# EAGLE design sensorstation_ok (EAGLE 6.2)
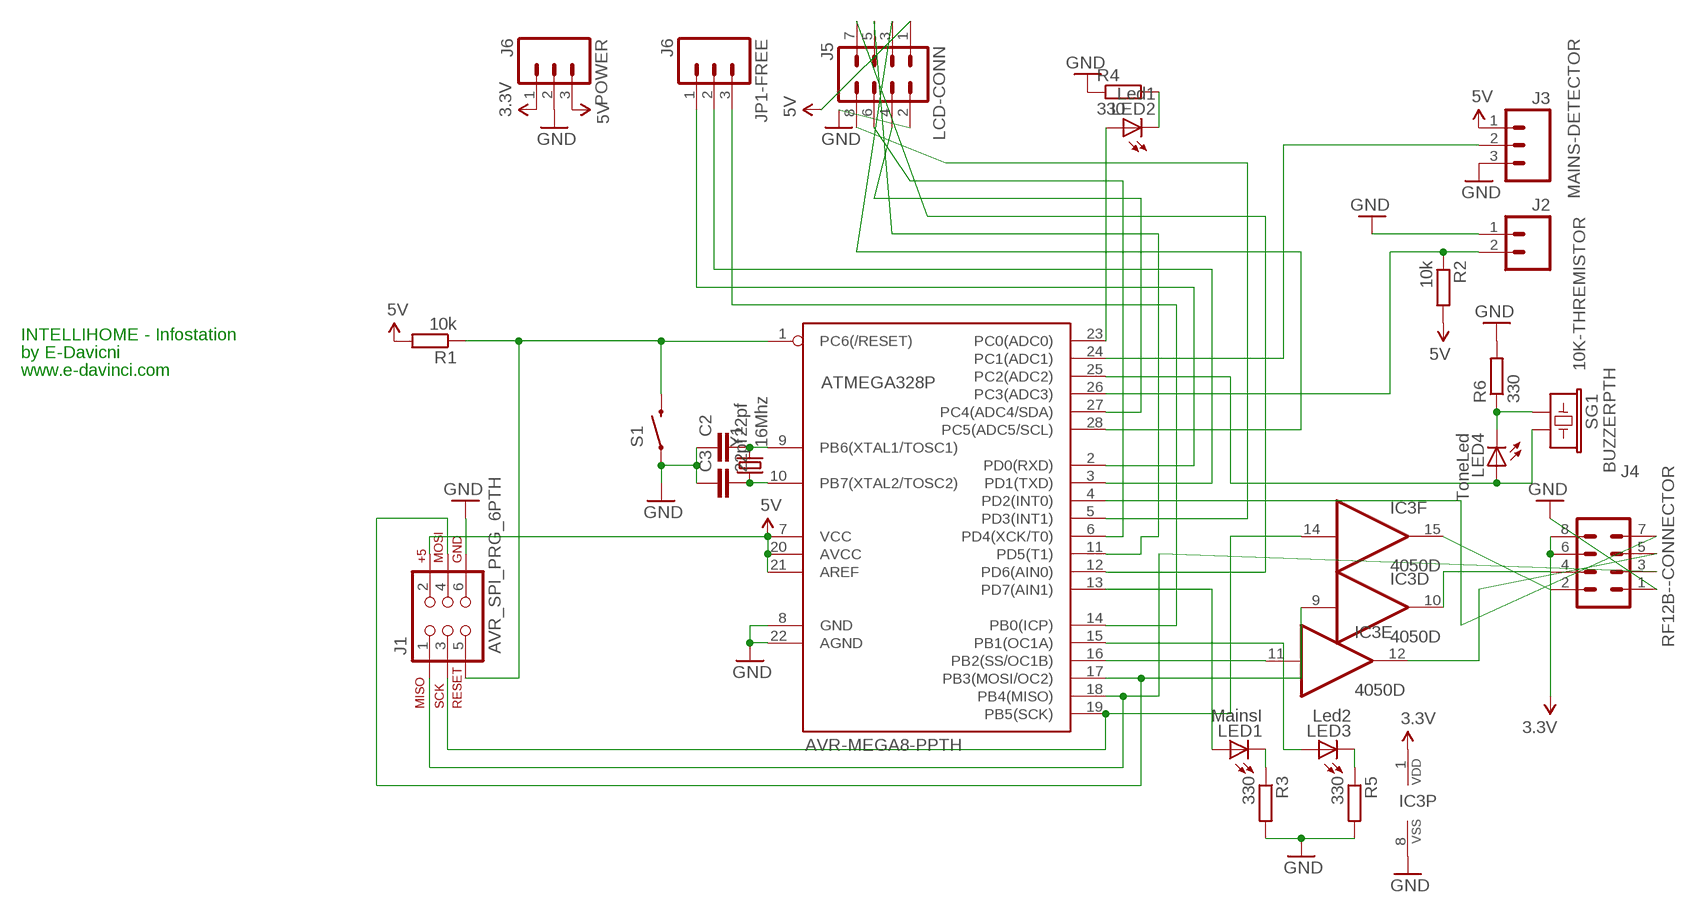
[diagram p0: schematic, sheet 1]

## Parts
10K-THREMISTOR  J2  M02PTH  [1X02]
ATMEGA328P  AVR-MEGA8-PPTH  [DIL28-3]
C2  22pf  CAPPTH  [CAP-PTH-SMALL]
C3  22pf  CAPPTH  [CAP-PTH-SMALL]
IC3  4050D  [SO16]
J1  AVR_SPI_PRG_6PTH  [2X3]
JP1-FREE  J6  M03PTH  [1X03]
LCD-CONN  J5  M04X2  [2X4]
LED1  MainsI  LED3MM  [LED3MM]
LED2  Led1  LED3MM  [LED3MM]
LED3  Led2  LED3MM  [LED3MM]
LED4  ToneLed  LED3MM  [LED3MM]
MAINS-DETECTOR  J3  M03PTH  [1X03]
POWER  J6  M03PTH  [1X03]
R1  10k  R-EU_0207/2V  [0207/2V]
R2  10k  R-EU_0207/2V  [0207/2V]
R3  330  R-EU_0207/2V  [0207/2V]
R4  330  R-EU_0207/2V  [0207/2V]
R5  330  R-EU_0207/2V  [0207/2V]
R6  330  R-EU_0207/2V  [0207/2V]
RF12B--CONNECTOR  J4  M04X2  [2X4]
S1  SWITCH-MOMENTARY-2PTH  [TACTILE-PTH]
SG1  BUZZERPTH  [BUZZER-12MM]
Y1  16Mhz  CRYSTALHC49US  [HC49US]

## Nets
3.3V: IC3.1(P:VDD) POWER.1 RF12B--CONNECTOR.6 RF12B--CONNECTOR.8
5V: ATMEGA328P.7(VCC) ATMEGA328P.20(AVCC) ATMEGA328P.21(AREF) J1.2 LCD-CONN.1 MAINS-DETECTOR.1 POWER.3 R1.2 R2.2
GND: 10K-THREMISTOR.1 ATMEGA328P.8(GND) ATMEGA328P.22(AGND) C2.1 C3.1 IC3.8(P:VSS) J1.6 LCD-CONN.2 MAINS-DETECTOR.3 POWER.2 R3.2 R4.1 R5.2 R6.2 RF12B--CONNECTOR.1 S1.1
N$1: ATMEGA328P.4(PD2(INT0)) RF12B--CONNECTOR.7
N$2: ATMEGA328P.16(PB2(SS/OC1B)) IC3.11(E:I)
N$3: ATMEGA328P.19(PB5(SCK)) IC3.14(F:I) J1.3
N$4: ATMEGA328P.17(PB3(MOSI/OC2)) IC3.9(D:I) J1.4
N$5: IC3.10(D:O) RF12B--CONNECTOR.4
N$6: ATMEGA328P.9(PB6(XTAL1/TOSC1)) C2.2 Y1.2
N$7: ATMEGA328P.10(PB7(XTAL2/TOSC2)) C3.2 Y1.1
N$8: ATMEGA328P.24(PC1(ADC1)) MAINS-DETECTOR.2
N$9: 10K-THREMISTOR.2 ATMEGA328P.26(PC3(ADC3)) R2.1
N$10: LED1.K(C) R3.1
N$11: LED4.K(C) R6.1 SG1.+
N$12: LED2.K(C) R4.2
N$13: LED3.K(C) R5.1
N$14: ATMEGA328P.23(PC0(ADC0)) LED2.A
N$15: ATMEGA328P.15(PB1(OC1A)) LED3.A
N$16: ATMEGA328P.25(PC2(ADC2)) LED4.A SG1.-
N$17: ATMEGA328P.14(PB0(ICP)) JP1-FREE.3
N$18: IC3.15(F:O) RF12B--CONNECTOR.2
N$20: IC3.12(E:O) RF12B--CONNECTOR.5
N$22: ATMEGA328P.13(PD7(AIN1)) LED1.A
N$23: ATMEGA328P.18(PB4(MISO)) J1.1 RF12B--CONNECTOR.3
N$24: ATMEGA328P.12(PD6(AIN0)) LCD-CONN.7
N$25: ATMEGA328P.11(PD5(T1)) LCD-CONN.5
N$26: ATMEGA328P.6(PD4(XCK/T0)) LCD-CONN.6
N$27: ATMEGA328P.5(PD3(INT1)) LCD-CONN.8
N$28: ATMEGA328P.3(PD1(TXD)) JP1-FREE.2
N$29: ATMEGA328P.2(PD0(RXD)) JP1-FREE.1
N$30: ATMEGA328P.27(PC4(ADC4/SDA)) LCD-CONN.4
N$31: ATMEGA328P.28(PC5(ADC5/SCL)) LCD-CONN.3
N$34: ATMEGA328P.1(PC6(/RESET)) J1.5 R1.1 S1.3
Unconnected: IC3.2(A:O) IC3.3(A:I) IC3.4(B:O) IC3.5(B:I) IC3.6(C:O) IC3.7(C:I)

## Notes on the sheet
- INTELLIHOME - Infostation
- by E-Davicni
- www.e-davinci.com

## Library data of the parts
10K-THREMISTOR = SparkFun:M02: Header 2 Standard 2-pin 0.1" header. Use with straight break away headers (SKU : PRT-00116), right angle break away headers (PRT-00553), swiss pins (PRT-00743), machine pins (PRT-00117), and female headers (PRT-00115). Molex polarized connector foot print use with SKU : PRT-08233 with associated crimp pins and housings.
ATMEGA328P = SparkFun:AVR-MEGA8-P: MICROCONTROLLER 8 Kbytes FLASH 1 kbytes SRAM 512 bytes EEPROM USART 4-channel 10 bit ADC 2-channel 8 bit ADC
C2 C3 = SparkFun:CAP: Capacitor Standard 0603 ceramic capacitor, and 0.1" leaded capacitor.
IC3 = 40xx:4050: Hex non-inverting BUFFER
J1 = SparkFun:AVR_SPI_PRG_6: AVR ISP 6 Pin This is the reduced ISP connector for AVR programming. Common on Arduino. This footprint will take up less PCB space and can be used with a 10-pin to 6-pin adapter such as SKU: BOB-08508
JP1-FREE MAINS-DETECTOR POWER = SparkFun:M03: Header 3 Standard 3-pin 0.1" header. Use with straight break away headers (SKU : PRT-00116), right angle break away headers (PRT-00553), swiss pins (PRT-00743), machine pins (PRT-00117), and female headers (PRT-00115). Molex polarized connector foot print use with SKU : PRT-08232 with associated crimp pins and housings.
LCD-CONN RF12B--CONNECTOR = SparkFun:M04X2
LED1-LED4 = SparkFun:LED: LEDs Standard schematic elements and footprints for 5mm, 3mm, 1206, and 0603 sized LEDs. 5mm - Spark Fun Electronics SKU : COM-00529 (and others)
R1-R6 = resistor:R-EU_: RESISTOR, European symbol
S1 = SparkFun:SWITCH-MOMENTARY-2
SG1 = SparkFun:BUZZER: Buzzer 12mm Spark Fun Electronics SKU : Comp-Buzzer
Y1 = SparkFun:CRYSTAL: Crystals Various standard crystals. Proven footprints. Spark Fun Electronics SKU : COM-00534

## Board
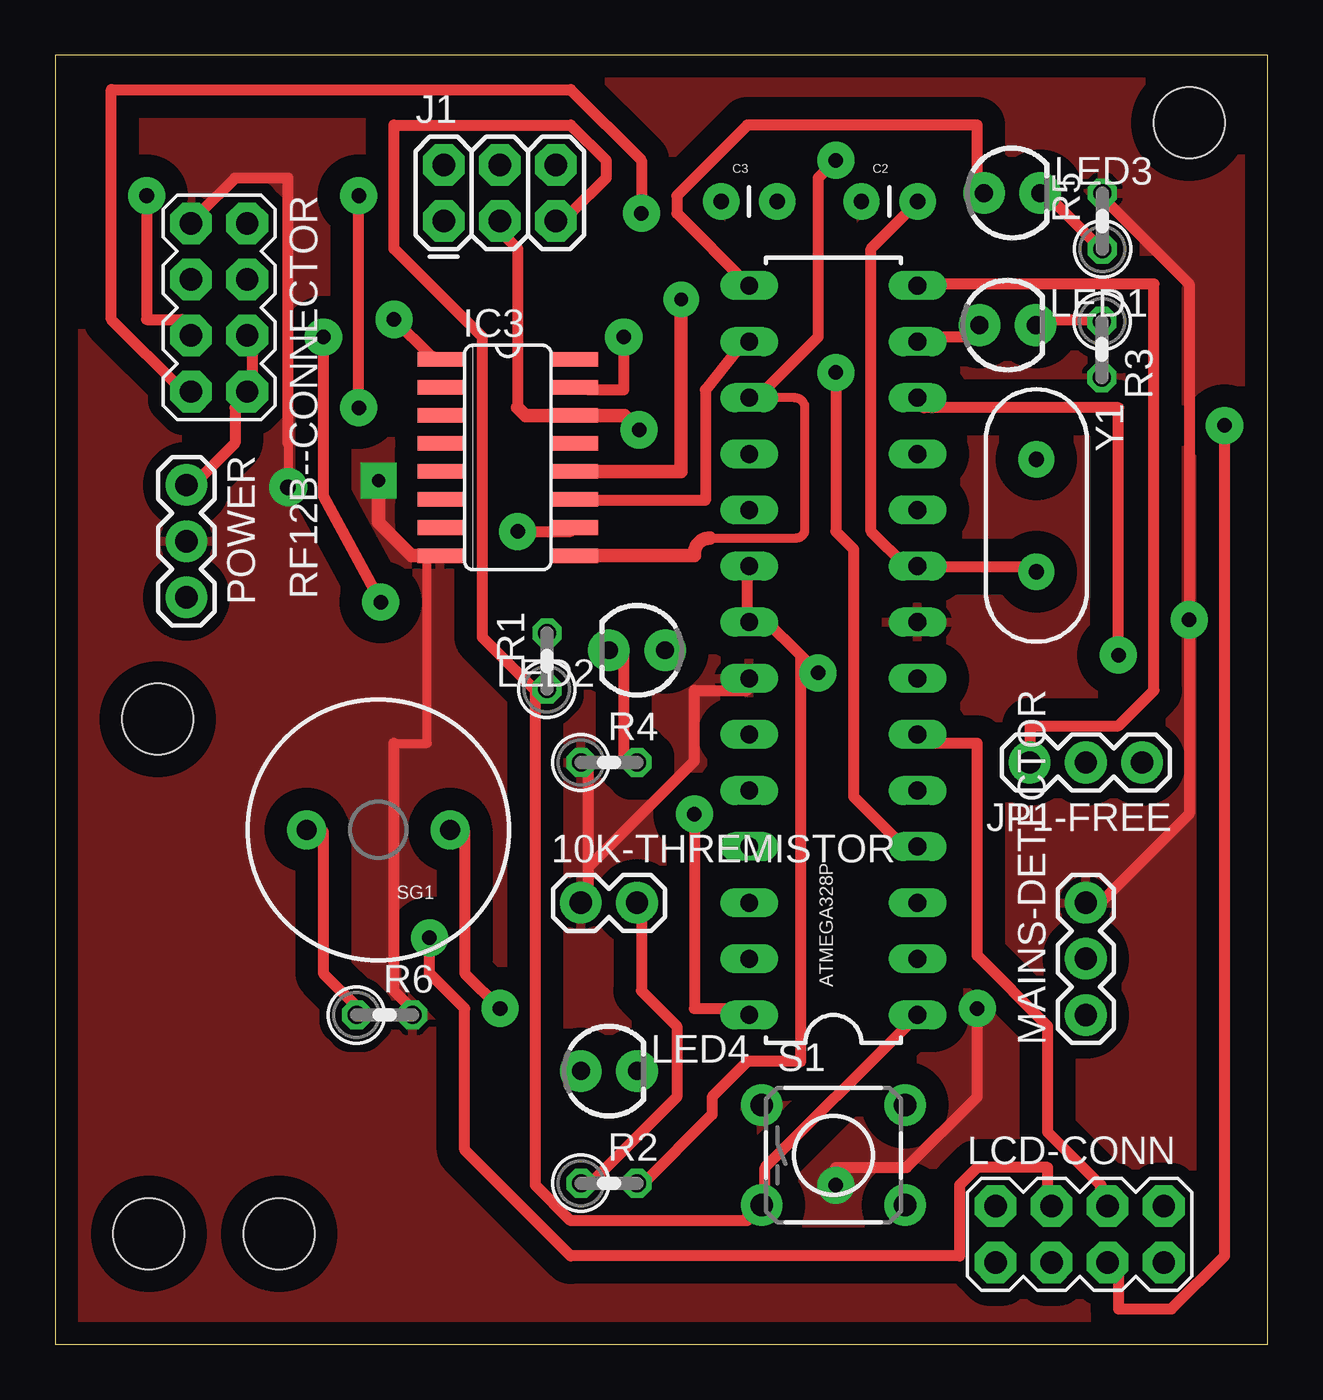
[diagram p1: board, top side]
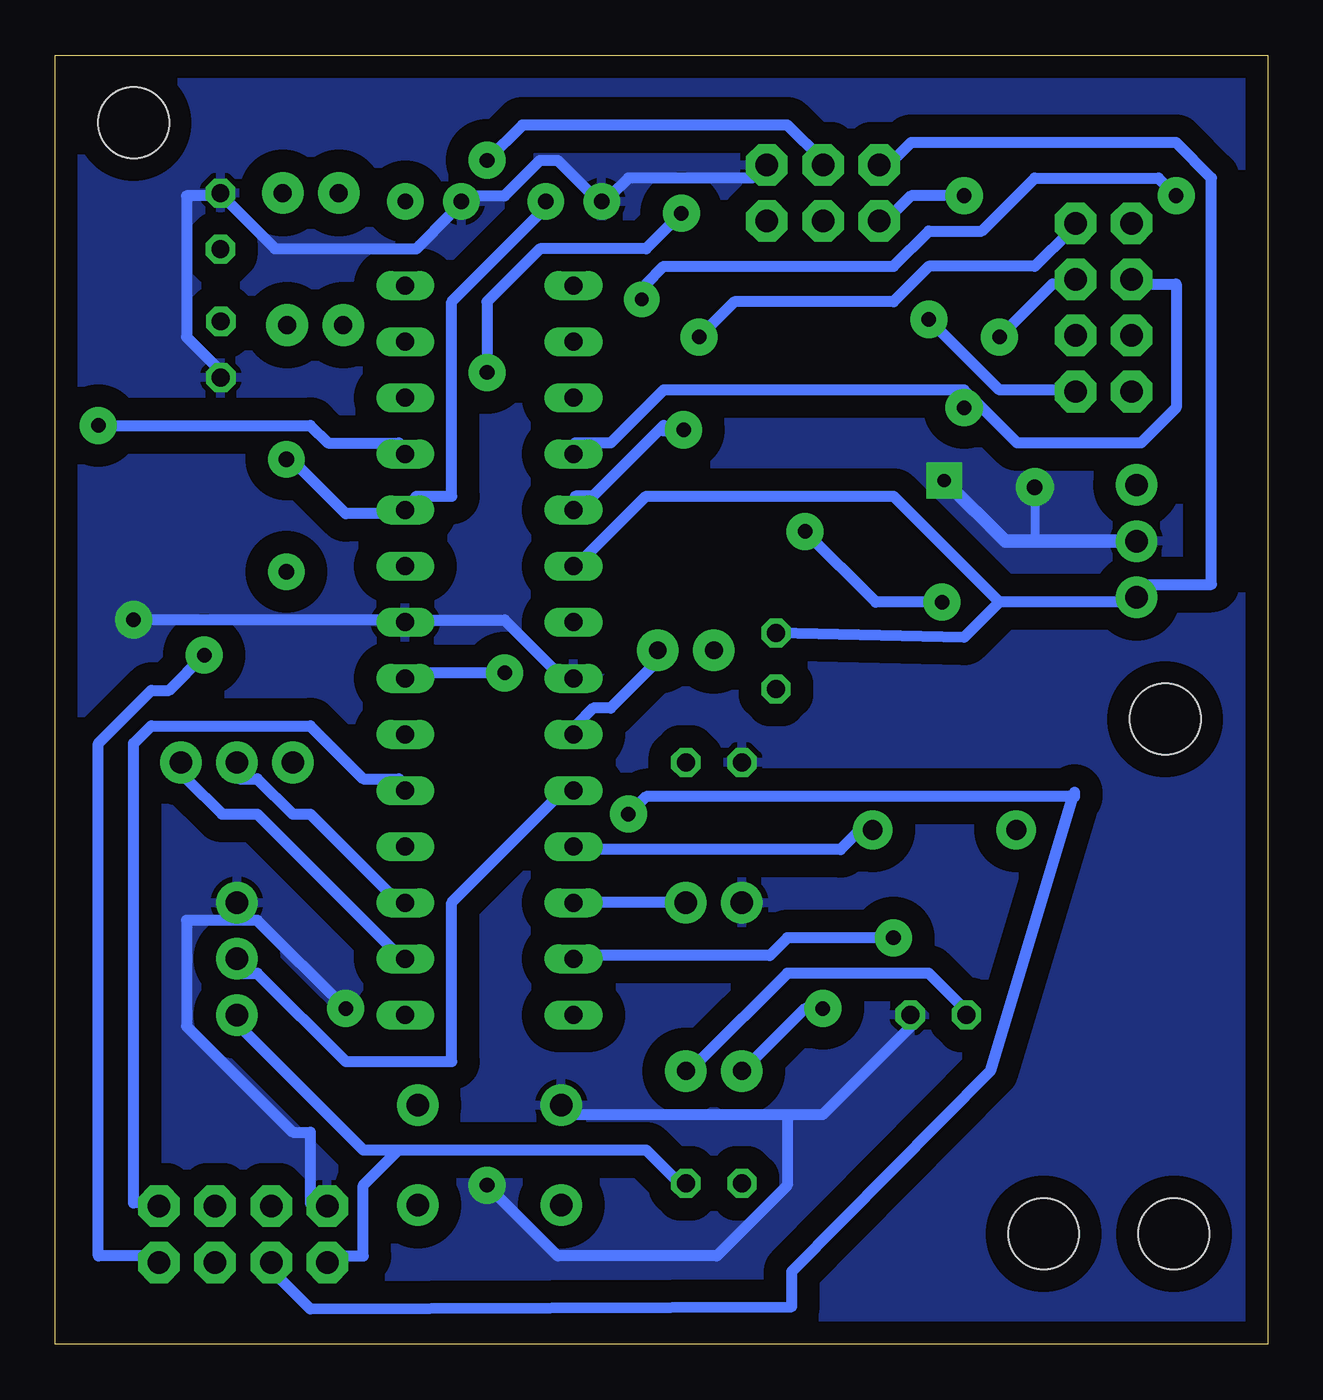
[diagram p2: board, bottom side, seen from below]

Size 54.89 x 58.36 mm. Coordinates in mm from the lower left corner, seen from the top.
Outline: 0,0 54.89,0 54.89,58.36 0,58.36 0,0
Copper layers (1*16): Top 0.035mm / dielectric 1.5mm / Bottom 0.035mm
Design rules: minimum track width 20mil, minimum drill 26mil, track to track 13mil, track to pad 16mil, pad to pad 16mil, via to via 16mil, smd to smd 8mil, copper to edge 30mil, drill to drill 8mil, minimum pad ring 10mil, minimum via ring 20mil, stop-mask expansion 4mil, vias tented up to drill 0mil, thermal gap 10mil
Holes 3.2 mm at 10.14,5 4.24,5 4.64,28.3 51.34,55.3

### Footprints (pad centres in the part's own frame; a part is rotated, then mirrored left to right if it is on the bottom)
1X02 = drill 1.016 pad 1.88: 1 0,0; 2 2.54,0
DIL28-3 = drill 0.813 long: 1 -16.51,-3.81; 2 -13.97,-3.81; 3 -11.43,-3.81; 4 -8.89,-3.81; 5 -6.35,-3.81; 6 -3.81,-3.81; 7 -1.27,-3.81; 8 1.27,-3.81; 9 3.81,-3.81; 10 6.35,-3.81; 11 8.89,-3.81; 12 11.43,-3.81; 13 13.97,-3.81; 14 16.51,-3.81; 15 16.51,3.81; 16 13.97,3.81; 17 11.43,3.81; 18 8.89,3.81; 19 6.35,3.81; 20 3.81,3.81; 21 1.27,3.81; 22 -1.27,3.81; 23 -3.81,3.81; 24 -6.35,3.81; 25 -8.89,3.81; 26 -11.43,3.81; 27 -13.97,3.81; 28 -16.51,3.81
CAP-PTH-SMALL = drill 0.7 pad 1.651: 1 0,0; 2 2.54,0
SO16 = smd 0.66 x 2.032: 1 -4.445,-3.073; 2 -3.175,-3.073; 3 -1.905,-3.073; 4 -0.635,-3.073; 5 0.635,-3.073; 6 1.905,-3.073; 7 3.175,-3.073; 8 4.445,-3.073; 9 4.445,3.073; 10 3.175,3.073; 11 1.905,3.073; 12 0.635,3.073; 13 -0.635,3.073; 14 -1.905,3.073; 15 -3.175,3.073; 16 -4.445,3.073
2X3 = drill 1.016 pad 1.88 octagon: 1 0,0; 2 0,2.54; 3 2.54,0; 4 2.54,2.54; 5 5.08,0; 6 5.08,2.54
1X03 = drill 1.016 pad 1.88: 1 0,0; 2 2.54,0; 3 5.08,0
2X4 = drill 1.016 pad 1.88 octagon: 1 -3.81,-1.27; 2 -3.81,1.27; 3 -1.27,-1.27; 4 -1.27,1.27; 5 1.27,-1.27; 6 1.27,1.27; 7 3.81,-1.27; 8 3.81,1.27
LED3MM = drill 0.813 pad 1.88: A -1.27,0; K 1.27,0
0207/2V = drill 0.813 octagon: 1 -1.27,0; 2 1.27,0
TACTILE-PTH = drill 1.016 pad 1.88: 1 -3.251,2.261; 2 3.251,2.261; 3 -3.251,-2.261; 4 3.251,-2.261
BUZZER-12MM = drill 0.9 pad 1.778: + 3.25,0; - -3.25,0
HC49US = drill 0.7 pad 1.651: 1 -2.54,0; 2 2.54,0

### Placement (x,y rotation side)
10K-THREMISTOR  23.8,19.99 0 top
ATMEGA328P  35.23,31.42 90 top
C2  36.5,51.74 0 top
C3  30.15,51.74 0 top
IC3  20.49,40.15 270 top
J1  17.59,50.85 0 top
JP1-FREE  49.2,26.34 180 top
LCD-CONN  46.38,4.98 0 top
LED1  43.12,46.14 0 top
LED2  26.34,31.42 180 top
LED3  43.32,52.12 0 top
LED4  25.07,12.37 0 top
MAINS-DETECTOR  46.66,14.91 90 top
POWER  5.94,38.9 270 top
R1  22.26,30.93 90 top
R2  25.07,7.29 0 top
R3  47.39,45.04 270 top
R4  25.07,26.34 0 top
R5  47.41,50.85 90 top
R6  14.91,14.91 0 top
RF12B--CONNECTOR  7.42,46.94 270 top
S1  35.23,8.56 0 top
SG1  14.63,23.29 180 top
Y1  44.42,37.52 270 top

### Tracks (layer width: path | path; a pad name or v marks a point on that pad's centre or on a via)
3.3V  (via drill 0.66)
  Top 0.508: v15.34,46.4 16.94,44.8 IC3.1 | POWER.1 6.54,39.2 8.14,40.8 8.14,42.4 RF12B--CONNECTOR.8 8.94,43.2 8.94,45.6 RF12B--CONNECTOR.6
  Bottom 0.508: v15.34,46.4 12.14,43.2 8.94,43.2 RF12B--CONNECTOR.8
5V  (via drill 0.66)
  Top 0.508: 33.74,31.2 32.14,32.8 ATMEGA328P.21 31.34,32.8 31.34,35.2 ATMEGA328P.20 | 33.74,31.2 v34.54,30.4 | 33.74,31.2 33.74,12.8 31.34,12.8 29.74,11.2 29.74,10.4 26.54,7.2 R2.2
  Bottom 0.508: 39.34,8.8 40.94,8.8 46.54,14.4 MAINS-DETECTOR.1 | 39.34,8.8 28.14,8.8 26.54,7.2 R2.2 | v34.54,30.4 38.54,30.4 ATMEGA328P.7 | 12.14,33.6 13.74,32 R1.2 | 12.14,33.6 6.54,33.6 POWER.3 5.74,34.4 2.54,34.4 2.54,52.8 4.14,54.4 16.14,54.4 16.94,53.6 J1.2 | 39.34,8.8 40.94,7.2 40.94,4 42.54,4 LCD-CONN.1 | 12.14,33.6 16.94,38.4 28.14,38.4 31.34,35.2 ATMEGA328P.20
GND  (via drill 0.6, 0.66, 0.7)
  Top 0.406: 15.34,27.2 16.84,27.2 16.84,35.7 | 10.54,40.8 v10.54,38.8
  Top 0.508: 24.14,21.6 24.14,20 10K-THREMISTOR.1 | 24.14,21.6 24.14,26.4 R4.1 | 24.14,21.6 28.94,26.4 28.94,29.6 31.34,29.6 ATMEGA328P.22 | MAINS-DETECTOR.3 47.34,20 51.34,24 v51.34,32.8 51.34,48 47.34,52 R5.2 | 10.54,40.8 10.54,52.8 8.14,52.8 6.54,51.2 RF12B--CONNECTOR.1 | v41.74,15.2 41.74,11.2 38.54,8 35.34,8 v35.34,7.2 | 15.34,27.2 15.34,16 16.14,15.2 R6.2
  Top 0.61: IC3.8 16.84,35.7 16.14,35.7 14.64,37.2 v14.64,39.1
  Bottom 0.406: v10.54,38.8 10.54,36.36
  Bottom 0.508: 21.74,10.4 31.34,10.4 S1.1 | 21.74,10.4 20.14,10.4 16.14,14.4 R6.2 | ATMEGA328P.22 32.14,30.4 34.54,32.8 38.54,32.8 ATMEGA328P.8 39.34,32.8 v51.34,32.8 | J1.6 23.34,52.8 28.94,52.8 29.74,52 C3.1 30.54,52 32.14,53.6 32.94,53.6 34.54,52 36.14,52 C2.1 36.94,51.2 38.54,49.6 44.94,49.6 47.34,52 | 47.34,52 48.94,52 48.94,45.6 47.34,44 R3.2 | 47.34,52 R5.2 | 46.54,19.2 48.94,19.2 48.94,14.4 44.14,9.6 43.34,9.6 43.34,6.4 LCD-CONN.2 | 46.54,19.2 45.74,19.2 v41.74,15.2 | v35.34,7.2 32.14,4 24.94,4 21.74,7.2 21.74,10.4 | 46.54,19.2 MAINS-DETECTOR.3
  Bottom 0.61: v14.64,39.1 11.88,36.36 10.54,36.36 POWER.2
  pour Top (isolate 1.016): 0.54,58 0.54,0.3 54.64,0.3 54.44,57.8
  pour Bottom (isolate 1.016): 0.54,58.2 54.94,57.8 54.94,0.4 0.44,0.4
N$1  (via drill 0.66)
  Top 0.508: v35.34,44 35.34,36.8 36.14,36 36.14,24.8 38.54,22.4 ATMEGA328P.4 | v26.54,51.2 26.54,53.6 23.34,56.8 2.54,56.8 2.54,46.4 5.74,43.2 RF12B--CONNECTOR.7
  Bottom 0.508: v35.34,44 35.34,47.2 32.94,49.6 28.14,49.6 v26.54,51.2
N$2
  Top 0.508: IC3.11 24.14,38.2 29.44,38.2 29.44,43.2 31.34,45.6 ATMEGA328P.16
N$3  (via drill 0.66)
  Top 0.508: 20.94,42.4 20.94,49.6 20.14,50.4 J1.3
  Top 0.61: 20.94,42.4 21.29,42.05 IC3.14 25.79,42.05 v26.44,41.4
  Bottom 0.508: ATMEGA328P.19 31.34,38.4 30.54,38.4 27.34,41.6 27.34,41.4
  Bottom 0.61: v26.44,41.4 27.34,41.4
N$4  (via drill 0.66)
  Top 0.406: 29.64,36.5 33.54,36.5 arc90 33.94,36.9 33.94,42.4 arc90 33.49,42.85 ATMEGA328P.17
  Top 0.508: v35.34,53.6 34.54,52.8 34.54,45.6 32.14,43.2 ATMEGA328P.17
  Top 0.61: IC3.9 28.94,35.7 28.94,35.8 arc-90 29.64,36.5
  Bottom 0.508: v35.34,53.6 33.74,55.2 21.74,55.2 20.14,53.6 J1.4
N$5  (via drill 0.66)
  Top 0.508: v20.94,36.8 23.34,36.8 IC3.10 | v14.74,33.6 12.14,38.4 v12.14,45.6
  Bottom 0.508: v20.94,36.8 17.74,33.6 v14.74,33.6 | v12.14,45.6 9.74,48 8.94,48 RF12B--CONNECTOR.4
N$6
  Top 0.508: C2.2 38.54,51.2 36.94,49.6 36.94,36.8 38.54,35.2 ATMEGA328P.9 39.34,35.2 44.14,35.2 Y1.2
N$7
  Bottom 0.508: C3.2 32.94,51.2 36.94,47.2 36.94,38.4 38.54,38.4 ATMEGA328P.10 39.34,37.6 41.74,37.6 44.14,40 Y1.1
N$8
  Bottom 0.508: ATMEGA328P.24 32.14,24.8 36.94,20 36.94,12.8 41.74,12.8 45.74,16.8 46.54,16.8 MAINS-DETECTOR.2
N$9
  Top 0.508: R2.1 24.14,7.2 28.14,11.2 28.14,14.4 26.54,16 26.54,19.2 10K-THREMISTOR.2
  Bottom 0.508: ATMEGA328P.26 31.34,20 26.54,20 10K-THREMISTOR.2
N$10
  Top 0.508: R3.1 47.34,46.4 44.94,46.4 LED1.K
N$11
  Top 0.508: R6.1 13.74,15.2 12.14,16.8 12.14,23.2 SG1.+
  Bottom 0.508: LED4.K 25.74,12.8 21.74,16.8 15.34,16.8 13.74,15.2 R6.1
N$12
  Top 0.508: R4.2 25.74,26.4 25.74,31.2 LED2.K
N$13
  Top 0.508: R5.1 47.34,49.6 44.94,52 LED3.K
N$14
  Bottom 0.508: ATMEGA328P.23 31.34,28 30.54,28.8 29.74,28.8 27.34,31.2 LED2.A
N$15
  Top 0.508: ATMEGA328P.15 31.34,48 28.14,51.2 28.14,52 31.34,55.2 41.74,55.2 41.74,52.8 LED3.A
N$16  (via drill 0.66)
  Top 0.508: v20.14,15.2 18.54,16.8 18.54,23.2 SG1.-
  Bottom 0.508: ATMEGA328P.25 31.34,22.4 19.34,22.4 18.54,23.2 SG1.- | v20.14,15.2 20.94,15.2 23.34,12.8 LED4.A
N$17
  Top 0.508: ATMEGA328P.14 39.34,48 49.74,48 49.74,29.6 48.14,28 44.14,28 44.14,26.4 JP1-FREE.3
N$18  (via drill 0.66)
  Top 0.508: v25.74,45.6 25.74,43.2 24.14,43.2 IC3.15
  Bottom 0.508: v25.74,45.6 24.14,47.2 16.94,47.2 15.34,48.8 10.54,48.8 8.94,50.4 RF12B--CONNECTOR.2
N$20  (via drill 0.6, 0.66)
  Top 0.508: v4.14,52 4.14,46.4 5.74,46.4 RF12B--CONNECTOR.5
  Top 0.61: v28.34,47.3 28.34,39.5 23.56,39.5 IC3.12
  Bottom 0.508: v4.14,52 4.94,52.8 10.54,52.8 12.94,50.4 15.34,50.4 16.94,48.8 27.34,48.8 28.14,48 v28.34,47.3
N$22
  Top 0.508: ATMEGA328P.13 39.34,45.6 41.74,45.6 LED1.A
N$23  (via drill 0.66)
  Top 0.508: v13.74,42.4 v13.74,52
  Bottom 0.508: 12.94,42.4 11.34,40.8 5.74,40.8 4.14,42.4 4.14,48 5.74,48 RF12B--CONNECTOR.3 | 12.94,42.4 13.74,43.2 27.34,43.2 29.74,40.8 31.34,40.8 ATMEGA328P.18 | v13.74,52 16.14,52 16.94,51.2 J1.1 | 12.94,42.4 v13.74,42.4
N$24  (via drill 0.66)
  Top 0.508: v48.14,31.2 48.14,42.4 39.34,42.4 ATMEGA328P.12
  Bottom 0.508: v48.14,31.2 49.74,29.6 50.54,29.6 52.94,27.2 52.94,4 50.54,4 LCD-CONN.7
N$25  (via drill 0.66)
  Top 0.508: v52.94,41.6 52.94,4 50.54,1.6 48.14,1.6 48.14,3.2 LCD-CONN.5
  Bottom 0.508: v52.94,41.6 43.34,41.6 42.54,40.8 39.34,40.8 ATMEGA328P.11
N$26
  Top 0.508: ATMEGA328P.6 39.34,27.2 41.74,27.2 41.74,17.6 44.94,14.4 44.94,9.6 47.34,7.2 47.34,6.4 LCD-CONN.6
N$27
  Bottom 0.508: ATMEGA328P.5 39.34,25.6 40.94,25.6 43.34,28 50.54,28 51.34,27.2 51.34,6.4 50.54,6.4 LCD-CONN.8
N$28
  Bottom 0.508: ATMEGA328P.3 39.34,20 43.34,24 44.14,24 45.74,25.6 46.54,25.6 JP1-FREE.2
N$29
  Bottom 0.508: ATMEGA328P.2 39.34,17.6 45.74,24 47.34,24 48.94,25.6 JP1-FREE.1
N$30  (via drill 0.66)
  Top 0.508: v16.94,18.4 16.94,16.8 18.54,15.2 18.54,8.8 23.34,4 40.94,4 40.94,7.2 41.74,8 44.94,8 44.94,6.4 LCD-CONN.4
  Bottom 0.508: v16.94,18.4 21.74,18.4 22.54,17.6 31.34,17.6 ATMEGA328P.27
N$31  (via drill 0.66)
  Top 0.508: v28.94,24 28.94,15.2 31.34,15.2 ATMEGA328P.28
  Bottom 0.508: v28.94,24 28.14,24.8 8.74,24.8 8.74,25 12.54,12.4 21.54,3.3 21.54,1.7 43.34,1.6 44.94,3.2 LCD-CONN.3
N$34
  Top 0.508: ATMEGA328P.1 38.54,14.4 32.14,8 32.14,6.4 S1.3 31.34,6.4 31.34,5.6 23.34,5.6 21.74,7.2 21.74,29.6 | 21.74,29.6 19.34,32 19.34,45.6 15.34,49.6 15.34,55.2 23.34,55.2 24.94,53.6 24.94,52.8 23.34,51.2 J1.5 | 21.74,29.6 R1.1